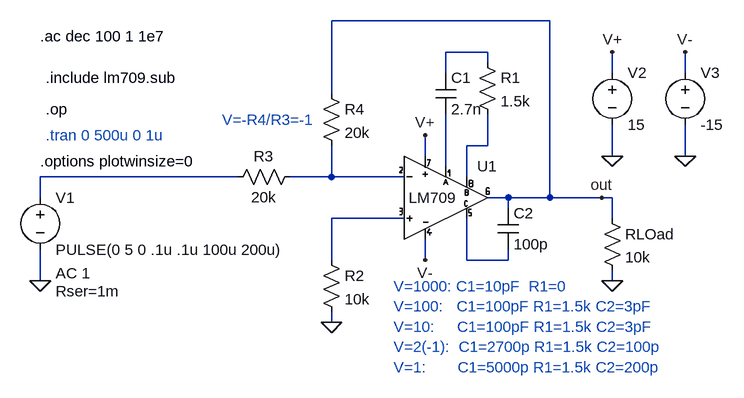
[diagram p0: schematic LM709_test.asc]
LM709_test.asc, the LTspice schematic file:
Version 4
SHEET 1 1284 1388
WIRE -1200 496 -1200 464
WIRE -1200 624 -1200 576
WIRE -896 464 -1200 464
WIRE -752 336 -752 224
WIRE -752 464 -816 464
WIRE -752 464 -752 416
WIRE -752 592 -752 528
WIRE -752 688 -752 672
WIRE -640 464 -752 464
WIRE -640 528 -752 528
WIRE -608 432 -608 400
WIRE -608 592 -608 560
WIRE -576 304 -576 272
WIRE -576 448 -576 368
WIRE -544 464 -544 416
WIRE -544 592 -544 528
WIRE -512 272 -576 272
WIRE -512 288 -512 272
WIRE -512 416 -544 416
WIRE -512 416 -512 368
WIRE -480 496 -512 496
WIRE -480 512 -480 496
WIRE -480 592 -544 592
WIRE -480 592 -480 576
WIRE -416 224 -752 224
WIRE -416 496 -480 496
WIRE -416 496 -416 224
WIRE -336 496 -416 496
WIRE -320 304 -320 272
WIRE -320 432 -320 384
WIRE -320 496 -336 496
WIRE -320 528 -320 496
WIRE -320 624 -320 608
WIRE -208 304 -208 272
WIRE -208 432 -208 384
FLAG -336 496 out
FLAG -1200 624 0
FLAG -320 432 0
FLAG -208 432 0
FLAG -320 272 V+
FLAG -208 272 V-
FLAG -320 624 0
FLAG -608 400 V+
FLAG -608 592 V-
FLAG -752 688 0
SYMBOL voltage -1200 480 R0
WINDOW 123 24 132 Left 0
WINDOW 39 24 160 Left 0
SYMATTR Value2 AC 1
SYMATTR SpiceLine Rser=1m
SYMATTR InstName V1
SYMATTR Value PULSE(0 5 0 .1u .1u 100u 200u)
SYMBOL voltage -320 288 R0
SYMATTR InstName V2
SYMATTR Value 15
SYMBOL voltage -208 288 R0
SYMATTR InstName V3
SYMATTR Value -15
SYMBOL res -336 512 R0
SYMATTR InstName RLOad
SYMATTR Value 10k
SYMBOL cap -592 304 R0
SYMATTR InstName C1
SYMATTR Value 2.7n
SYMBOL res -528 272 R0
SYMATTR InstName R1
SYMATTR Value 1.5k
SYMBOL cap -496 512 R0
SYMATTR InstName C2
SYMATTR Value 100p
SYMBOL res -768 576 R0
SYMATTR InstName R2
SYMATTR Value 10k
SYMBOL res -768 320 R0
SYMATTR InstName R4
SYMATTR Value 20k
SYMBOL res -912 480 R270
WINDOW 0 32 56 VTop 0
WINDOW 3 0 56 VBottom 0
SYMATTR InstName R3
SYMATTR Value 20k
SYMBOL LM709 -576 432 R0
SYMATTR InstName U1
TEXT -1192 400 Left 0 ;.tran 0 500u 0 1u
TEXT -1200 440 Left 0 !.options plotwinsize=0
TEXT -1192 360 Left 0 !.op
TEXT -656 632 Left 0 ;V=1000: C1=10pF  R1=0\nV=100:   C1=100pF R1=1.5k C2=3pF\nV=10:     C1=100pF R1=1.5k C2=3pF\nV=2(-1):  C1=2700p R1=1.5k C2=100p\nV=1:       C1=5000p R1=1.5k C2=200p
TEXT -920 376 Left 0 ;V=-R4/R3=-1
TEXT -1192 312 Left 0 !.include lm709.sub
TEXT -1200 248 Left 0 !.ac dec 100 1 1e7

The netlist it stands for:
* LM709_test.asc
V1 N001 0 PULSE(0 5 0 .1u .1u 100u 200u) AC 1 Rser=1m
V2 V+ 0 15
V3 V- 0 -15
RLOad out 0 10k
C1 N004 N005 2.7n
R1 N004 N006 1.5k
C2 out N007 100p
R2 N003 0 10k
R4 out N002 20k
R3 N001 N002 20k
XU1 N003 N002 V+ V- out N007 N005 N006 LM709 LM709  ; pins In+ In- V+ V- OUT COMP A B
* .tran 0 500u 0 1u
.options plotwinsize=0
.op
* V=1000: C1=10pF  R1=0
* V=100:   C1=100pF R1=1.5k C2=3pF
* V=10:     C1=100pF R1=1.5k C2=3pF
* V=2(-1):  C1=2700p R1=1.5k C2=100p
* V=1:       C1=5000p R1=1.5k C2=200p
* V=-R4/R3=-1
.include lm709.sub
.ac dec 100 1 1e7
.backanno
.end